# Altium schematic sheet 03_GYROSCOPE.SchDoc: ACCELEROMETER / GYRO
size A4; Author: Gabriel; Organization: Altium Limited; Address1: L3, 12a Rodborough Rd; Address2: Frenchs Forest; Address3: NSW; Address4: Australia 2086; SheetNumber: 3; SheetTotal: 1; Subtitle: XDRONE
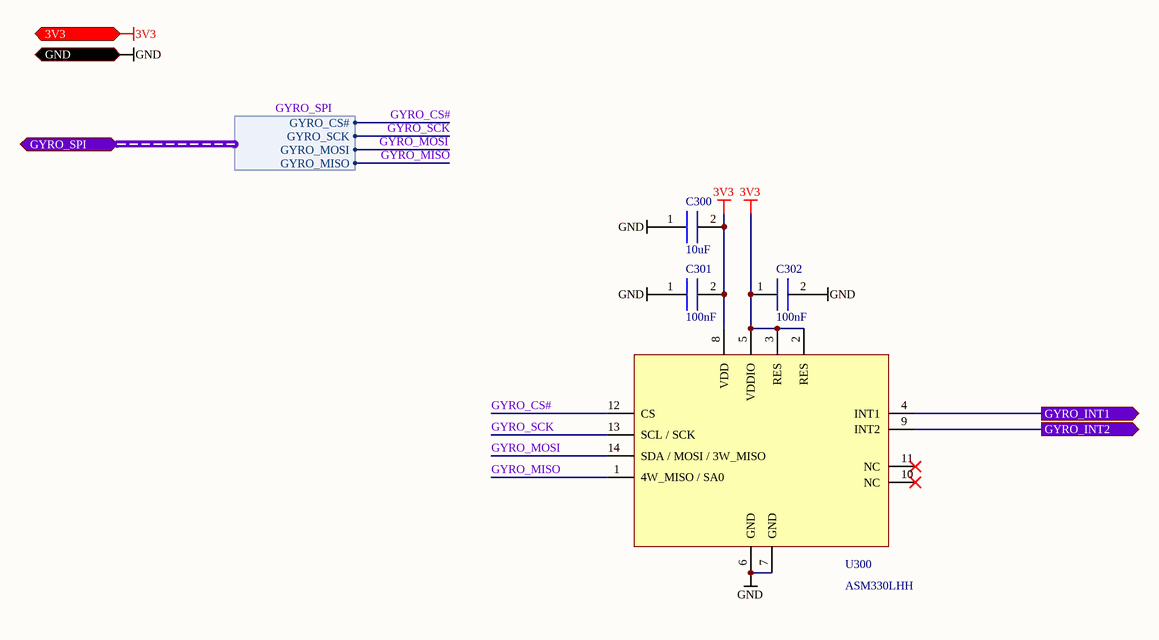
[diagram p0: 03_GYROSCOPE.SchDoc]

## Parts
C300  value 10uF  [CAP_0402]  (hidden comment: 10uF_20%_6.3V_0402_GRM155R60J106ME05D)
C301  value 100nF  [CAP_0402]  (hidden comment: 100nF_10%_16V_0402_GRM155R71C104KA88J)
C302  value 100nF  [CAP_0402]  (hidden comment: 100nF_10%_16V_0402_GRM155R71C104KA88J)
U300  MANUFACTURER REFERENCE: ASM330LHH  (hidden comment: GYRO_3D_3.6V_ACEL_ASM330LHH)

## Ports
3V3 (in), GND (in), GYRO_INT1 (out), GYRO_INT2 (out), GYRO_SPI (harness GYRO_SPI)

## Harnesses
GYRO_SPI: GYRO_CS#, GYRO_SCK, GYRO_MOSI, GYRO_MISO

## Nets
3V3: C300.2 C301.2 C302.1 U300.2(RES) U300.3(RES) U300.5(VDDIO) U300.8(VDD) ; port 3V3
GND: C300.1 C301.1 C302.2 U300.6(GND) U300.7(GND) ; port GND
GYRO_CS#: U300.12(CS) ; port GYRO_SPI.GYRO_CS#
GYRO_INT1: U300.4(INT1) ; port GYRO_INT1
GYRO_INT2: U300.9(INT2) ; port GYRO_INT2
GYRO_MISO: U300.1(4W_MISO_/_SA0) ; port GYRO_SPI.GYRO_MISO
GYRO_MOSI: U300.14(SDA_/_MOSI_/_3W_MISO) ; port GYRO_SPI.GYRO_MOSI
GYRO_SCK: U300.13(SCL_/_SCK) ; port GYRO_SPI.GYRO_SCK

Not connected (* = marked no-connect by the designer): U300 10(NC)* 11(NC)*

## Notes on the sheet
- TITLE:
- CREATED BY
- MODIFIED DATE
- PAGE
- /

## Library data of the parts
C300 = 10uF 20% 6.3V 0402 GRM155R60J106ME05D: CAPACITOR 10uF 20% 6.3V 0402 GRM155R60J106ME05D; MANUFACTURER: MURATA; DIELECTRIC: X5R; TOLERANCE: 20%; VOLTAGE RATING: 6.3V; PACKAGING: 0402; MOUNTING: SMD; MANUFACTURER REFERENCE: GRM155R60J106ME05D
C301 C302 = 100nF_10%_16V_0402_GRM155R71C104KA88J: CAPACITOR 100nF 10% X7R 0402; MANUFACTURER: MURATA; DIELECTRIC: X5R; VOLTAGE RATING: 16V; TOLERANCE: 10%; MOUNTING: SMD; MANUFACTURER REFERENCE: GRM155R71C104KA88J; PACKAGING: 0402
U300 = GYRO_3D_3.6V_ACEL_ASM330LHH: Gyroscope and accelerometer 3D 3.6V ASM330LHH; MANUFACTURER: ST; INPUT VOLTAGE MIN: 2V; INPUT VOLTAGE MAX: 3.6V; PACKAGING: 14-LGA; MOUNTING: SMD